# Altium schematic sheet schematic_e00_1.SchDoc
size 264 x 181 mm
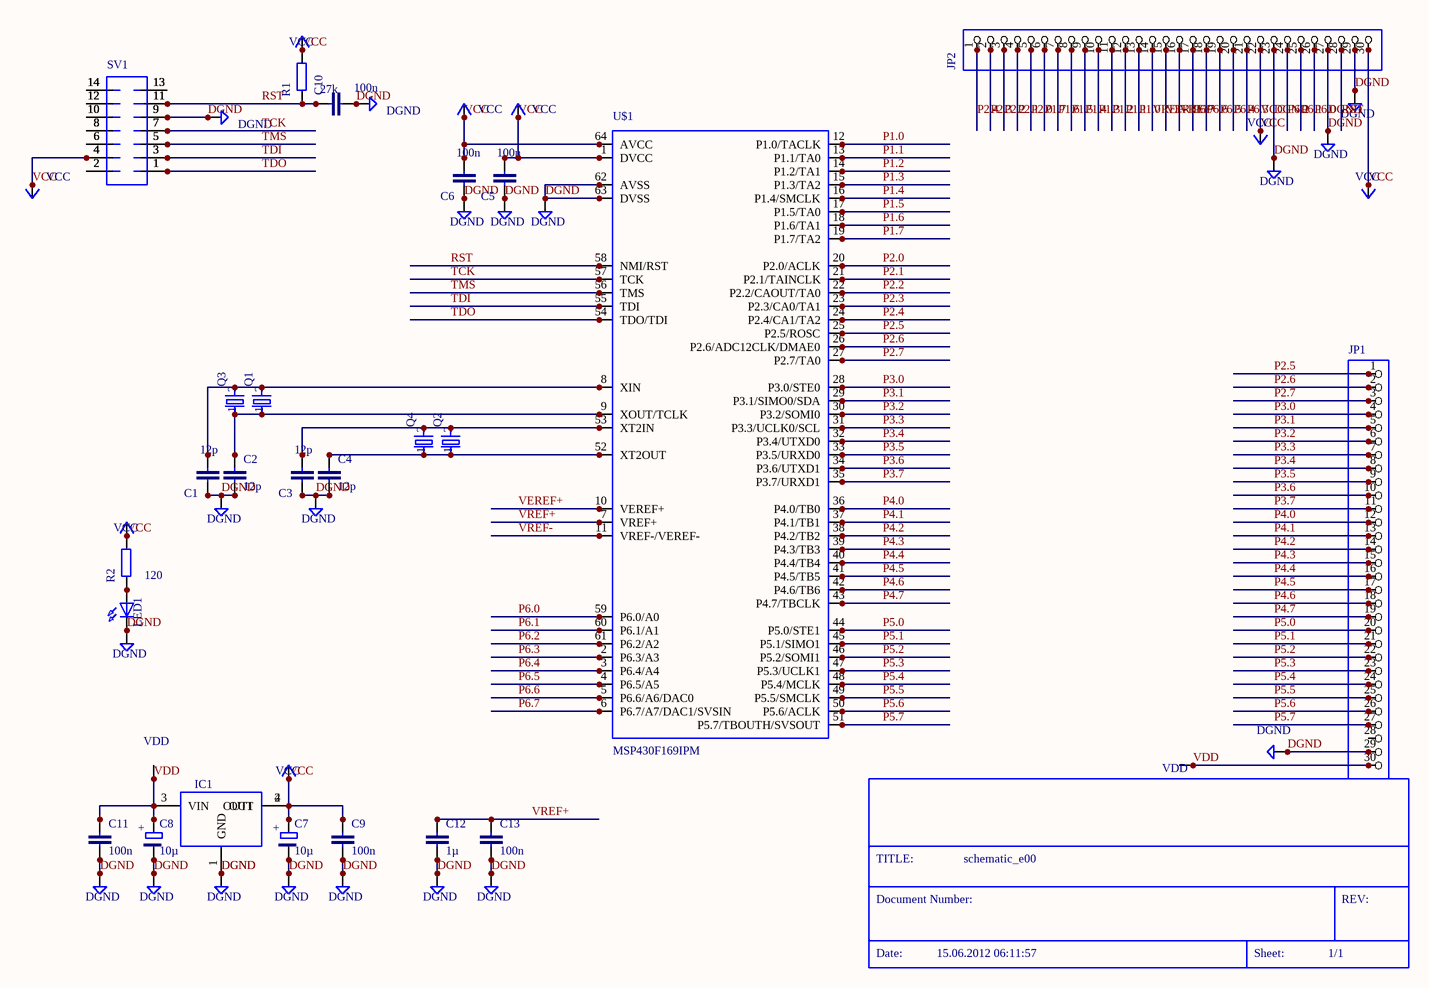
[diagram p0: schematic_e00_1.SchDoc]

## Parts
C1  12p  [C0805]
C2  12p  [C0805]
C3  12p  [C0805]
C4  12p  [C0805]
C5  100n  [C0805]
C6  100n  [C0805]
C7  10µ  [153CLV-0505]
C8  10µ  [153CLV-0505]
C9  100n  [C0805]
C10  100n  [C0805]
C11  100n  [C0805]
C12  1µ  [C0805]
C13  100n  [C0805]
FRAME1  (no value)  (parts A,B of 2)
IC1  (no value)  [SOT223]
JP1  (no value)  [1X30]
JP2  (no value)  [1X30]
LED1  (no value)  [P-LCC-2]
P+1  VCC
P+2  VCC
P+3  VCC
P+4  VCC
P+5  VCC
P+6  VCC
P+7  VCC
P+8  VCC
Q1  (no value)  [HC49U70]
Q2  (no value)  [HC49U70]
Q3  (no value)  [HC49UP]
Q4  (no value)  [HC49UP]
R1  27k  [R1206]
R2  120  [R0805]
SUPPLY1  DGND
SUPPLY2  DGND
SUPPLY3  DGND
SUPPLY4  DGND
SUPPLY5  DGND
SUPPLY6  DGND
SUPPLY7  DGND
SUPPLY8  DGND
SUPPLY9  VDD
SUPPLY10  DGND
SUPPLY11  DGND
SUPPLY12  DGND
SUPPLY13  DGND
SUPPLY14  DGND
SUPPLY15  DGND
SUPPLY16  DGND
SUPPLY17  DGND
SUPPLY18  DGND
SUPPLY19  VDD
SUPPLY20  DGND
SUPPLY21  DGND
SV1  (no value)  [ML14]
U$1  MSP430F169IPM  [S-PQFP64-G64]

## Nets
DGND: C1.1 C2.2 C3.1 C4.2 C5.1 C6.1 C7.- C8.- C9.2 C10.2 C11.2 C12.2 C13.2 IC1.1(GND) JP1.29 JP2.23 JP2.27 JP2.29 LED1.C SUPPLY1.0(DGND) SUPPLY2.0(DGND) SUPPLY3.0(DGND) SUPPLY4.0(DGND) SUPPLY5.0(DGND) SUPPLY6.0(DGND) SUPPLY7.0(DGND) SUPPLY8.0(DGND) SUPPLY10.0(DGND) SUPPLY11.0(DGND) SUPPLY12.0(DGND) SUPPLY13.0(DGND) SUPPLY14.0(DGND) SUPPLY15.0(DGND) SUPPLY16.0(DGND) SUPPLY17.0(DGND) SUPPLY18.0(DGND) SUPPLY20.0(DGND) SUPPLY21.0(DGND) SV1.9 U$1.62(AVSS) U$1.63(DVSS)
P1.0: JP2.13 U$1.12(P1.0/TACLK)
P1.1: JP2.12 U$1.13(P1.1/TA0)
P1.2: JP2.11 U$1.14(P1.2/TA1)
P1.3: JP2.10 U$1.15(P1.3/TA2)
P1.4: JP2.9 U$1.16(P1.4/SMCLK)
P1.5: JP2.8 U$1.17(P1.5/TA0)
P1.6: JP2.7 U$1.18(P1.6/TA1)
P1.7: JP2.6 U$1.19(P1.7/TA2)
P2.0: JP2.5 U$1.20(P2.0/ACLK)
P2.1: JP2.4 U$1.21(P2.1/TAINCLK)
P2.2: JP2.3 U$1.22(P2.2/CAOUT/TA0)
P2.3: JP2.2 U$1.23(P2.3/CA0/TA1)
P2.4: JP2.1 U$1.24(P2.4/CA1/TA2)
P2.5: JP1.1 U$1.25(P2.5/ROSC)
P2.6: JP1.2 U$1.26(P2.6/ADC12CLK/DMAE0)
P2.7: JP1.3 U$1.27(P2.7/TA0)
P3.0: JP1.4 U$1.28(P3.0/STE0)
P3.1: JP1.5 U$1.29(P3.1/SIMO0/SDA)
P3.2: JP1.6 U$1.30(P3.2/SOMI0)
P3.3: JP1.7 U$1.31(P3.3/UCLK0/SCL)
P3.4: JP1.8 U$1.32(P3.4/UTXD0)
P3.5: JP1.9 U$1.33(P3.5/URXD0)
P3.6: JP1.10 U$1.34(P3.6/UTXD1)
P3.7: JP1.11 U$1.35(P3.7/URXD1)
P4.0: JP1.12 U$1.36(P4.0/TB0)
P4.1: JP1.13 U$1.37(P4.1/TB1)
P4.2: JP1.14 U$1.38(P4.2/TB2)
P4.3: JP1.15 U$1.39(P4.3/TB3)
P4.4: JP1.16 U$1.40(P4.4/TB4)
P4.5: JP1.17 U$1.41(P4.5/TB5)
P4.6: JP1.18 U$1.42(P4.6/TB6)
P4.7: JP1.19 U$1.43(P4.7/TBCLK)
P5.0: JP1.20 U$1.44(P5.0/STE1)
P5.1: JP1.21 U$1.45(P5.1/SIMO1)
P5.2: JP1.22 U$1.46(P5.2/SOMI1)
P5.3: JP1.23 U$1.47(P5.3/UCLK1)
P5.4: JP1.24 U$1.48(P5.4/MCLK)
P5.5: JP1.25 U$1.49(P5.5/SMCLK)
P5.6: JP1.26 U$1.50(P5.6/ACLK)
P5.7: JP1.27 U$1.51(P5.7/TBOUTH/SVSOUT)
P6.0: JP2.26 U$1.59(P6.0/A0)
P6.1: JP2.25 U$1.60(P6.1/A1)
P6.2: JP2.24 U$1.61(P6.2/A2)
P6.3: JP2.21 U$1.2(P6.3/A3)
P6.4: JP2.20 U$1.3(P6.4/A4)
P6.5: JP2.19 U$1.4(P6.5/A5)
P6.6: JP2.18 U$1.5(P6.6/A6/DAC0)
P6.7: JP2.17 U$1.6(P6.7/A7/DAC1/SVSIN)
RST: C10.1 JP2.28 R1.1 SV1.11 U$1.58(NMI/RST)
TCK: SV1.7 U$1.57(TCK)
TDI: SV1.3 U$1.55(TDI)
TDO: SV1.1 U$1.54(TDO/TDI)
TMS: SV1.5 U$1.56(TMS)
VCC: C5.2 C6.2 C7.+ C9.1 IC1.2(OUT) IC1.4(OUT1) JP2.22 JP2.30 P+1.0(VCC) P+2.0(VCC) P+3.0(VCC) P+4.0(VCC) P+5.0(VCC) P+6.0(VCC) P+7.0(VCC) P+8.0(VCC) R1.2 R2.2 SV1.4 U$1.1(DVCC) U$1.64(AVCC)
VDD: C8.+ C11.1 IC1.3(VIN) JP1.30 SUPPLY9.0(VDD) SUPPLY19.0(VDD)
VEREF+: JP2.15 U$1.10(VEREF+)
VREF+: C12.1 C13.1 JP2.16 U$1.7(VREF+)
VREF-: JP2.14 U$1.11(VREF-/VEREF-)
NetC1_2: C1.2 Q1.2 Q3.2 U$1.8(XIN)
NetC2_1: C2.1 Q1.1 Q3.1 U$1.9(XOUT/TCLK)
NetC3_2: C3.2 Q2.2 Q4.2 U$1.53(XT2IN)
NetC4_1: C4.1 Q2.1 Q4.1 U$1.52(XT2OUT)
NetLED1_A: LED1.A R2.1

Not connected (* = marked no-connect by the designer): JP1 28; SV1 2 6 8 10 12 13 14

## Notes on the sheet
- (in symbol DINA4_L, part B) TITLE:; schematic_e00; Document Number:; REV:; Date:; 15.06.2012 06:11:57; Sheet:; 1/1

## Library data of the parts
C1-C6 C9-C13 = C-EUC0805
C7 C8 = CPOL-EU153CLV-0505
FRAME1 = DINA4_L
IC1 = LM1117
JP1 JP2 = PINHD-1X30
LED1 = LEDP-LCC-2
Q1 Q2 = CRYTALHC49U70
Q3 Q4 = CRYTALHC49UP
R1 = R-EU_R1206
R2 = R-EU_R0805
SV1 = ML14